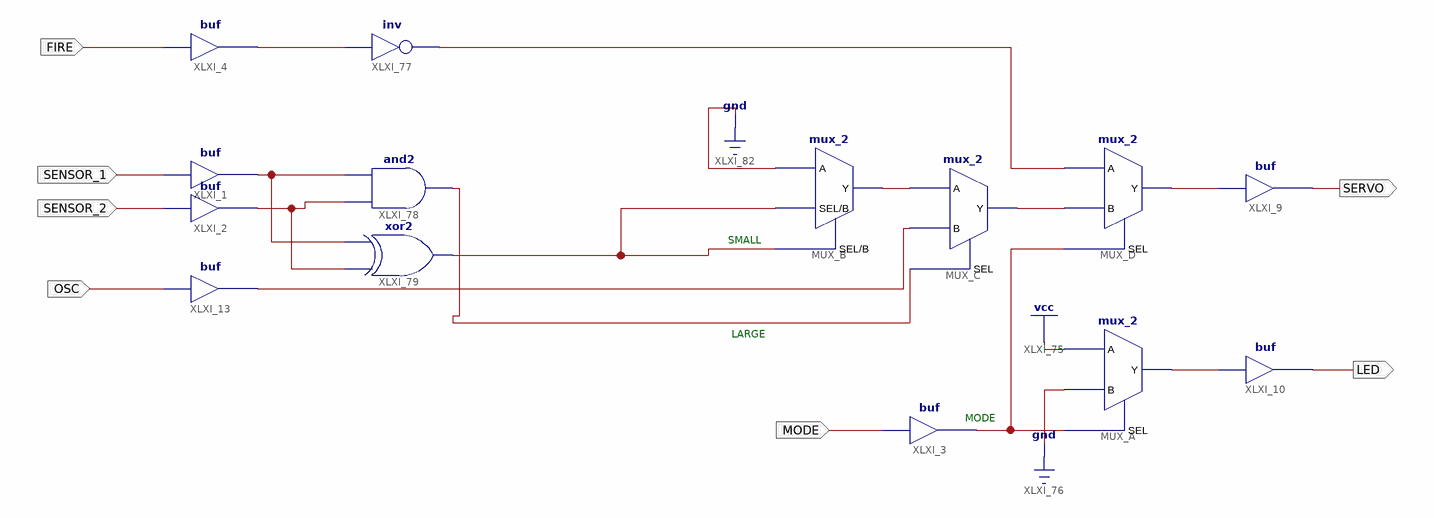
[diagram p0: schematic sheet 1]
// Xilinx ISE schematic bug_trap_controller.sch (zynq) as structural Verilog: 14 symbols, 7 ports
module bug_trap_controller (
  input  MODE,
  input  OSC,
  input  FIRE,
  input  SENSOR_1,
  input  SENSOR_2,
  output LED,
  output SERVO
);

  wire XLXN_179, XLXN_181, XLXN_182, XLXN_183, XLXN_203, XLXN_218, XLXN_223, XLXN_270, XLXN_271, XLXN_273,
       XLXN_274, XLXN_275;

  mux_2 MUX_A (.Y(XLXN_275), .SEL(XLXN_179), .B(1'b0), .A(1'b1));
  buf XLXI_10 (LED, XLXN_275);
  mux_2 MUX_D (.Y(XLXN_274), .SEL(XLXN_179), .B(XLXN_181), .A(XLXN_182));
  buf XLXI_9 (SERVO, XLXN_274);
  mux_2 MUX_C (.Y(XLXN_181), .SEL(XLXN_273), .B(XLXN_223), .A(XLXN_218));
  mux_2 MUX_B (.Y(XLXN_218), .SEL(XLXN_203), .B(XLXN_203), .A(1'b0));
  buf XLXI_3 (XLXN_179, MODE);
  buf XLXI_13 (XLXN_223, OSC);
  buf XLXI_4 (XLXN_183, FIRE);
  buf XLXI_1 (XLXN_270, SENSOR_1);
  buf XLXI_2 (XLXN_271, SENSOR_2);
  not XLXI_77 (XLXN_182, XLXN_183);
  and XLXI_78 (XLXN_273, XLXN_271, XLXN_270);
  xor XLXI_79 (XLXN_203, XLXN_271, XLXN_270);

  // Notes on the sheet:
  //   SMALL
  //   LARGE
  //   MODE
endmodule
